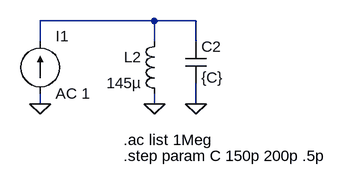
[diagram p0: schematic Optimize.asc]
Optimize.asc, the LTspice schematic file:
Version 4
SHEET 1 1268 692
WIRE -288 272 -288 240
WIRE -288 368 -288 352
WIRE -112 240 -288 240
WIRE -112 272 -112 240
WIRE -112 368 -112 352
WIRE -48 240 -112 240
WIRE -48 272 -48 240
WIRE -48 368 -48 336
FLAG -48 368 0
FLAG -112 368 0
FLAG -288 368 0
SYMBOL cap -64 272 R0
SYMATTR InstName C2
SYMATTR Value {C}
SYMBOL ind -96 256 M0
SYMATTR InstName L2
SYMATTR Value 145µ
SYMATTR SpiceLine Rpar=50K
SYMBOL current -288 352 M180
WINDOW 0 24 88 Left 0
WINDOW 3 24 0 Left 0
SYMATTR InstName I1
SYMATTR Value AC 1
TEXT -160 424 Left 0 !.ac list 1Meg
TEXT -160 448 Left 0 !.step param C 150p 200p .5p

The netlist it stands for:
* Optimize.asc
C2 N001 0 {C}
L2 N001 0 145µ Rpar=50K
I1 0 N001 AC 1
.ac list 1Meg
.step param C 150p 200p .5p
.backanno
.end